# EAGLE schematic Layer 3 (EAGLE 9.6.2)

## Sheet 1 of 6
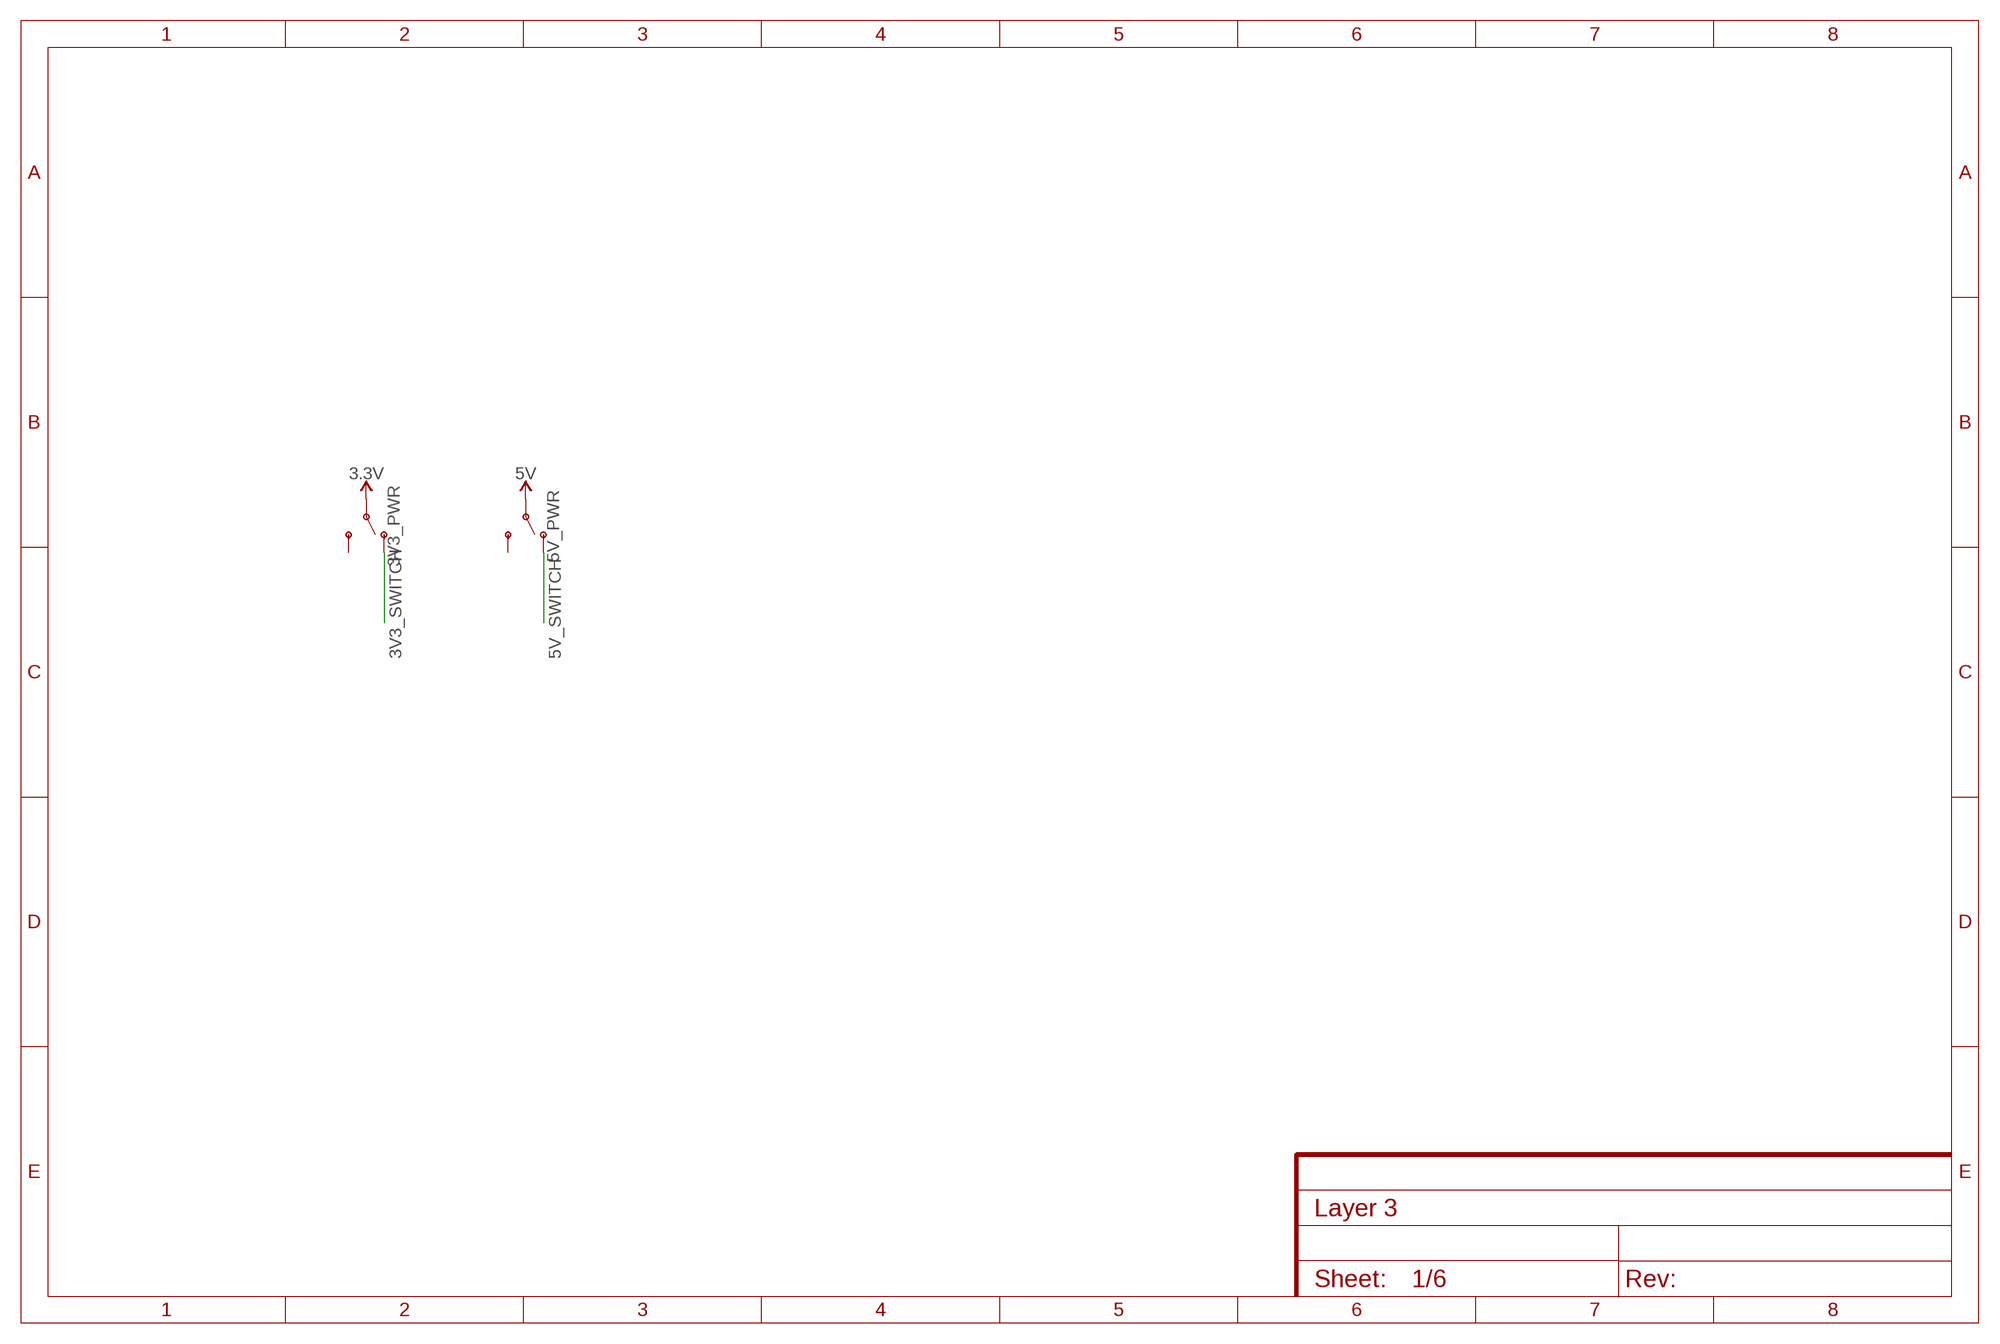
[diagram p0: schematic, sheet 1]

### Parts
3V3_PWR  SWITCH-SPDT-PTH-11.6X4.0MM-LOCK  [SWITCH_SPDT_PTH_11.6X4.0MM_LOCK]
5V_PWR  SWITCH-SPDT-PTH-11.6X4.0MM-LOCK  [SWITCH_SPDT_PTH_11.6X4.0MM_LOCK]

### Nets
3.3V: 3V3_PWR.2(P) ; also sheet 4,5,6
3V3_SWITCH: 3V3_PWR.1(O) ; also sheet 2,3,4,6
5V: 5V_PWR.2(P) ; also sheet 5
5V_SWITCH: 5V_PWR.1(O) ; also sheet 4
Unconnected: 3V3_PWR.3(S) 5V_PWR.3(S)

## Sheet 2 of 6: STEM32
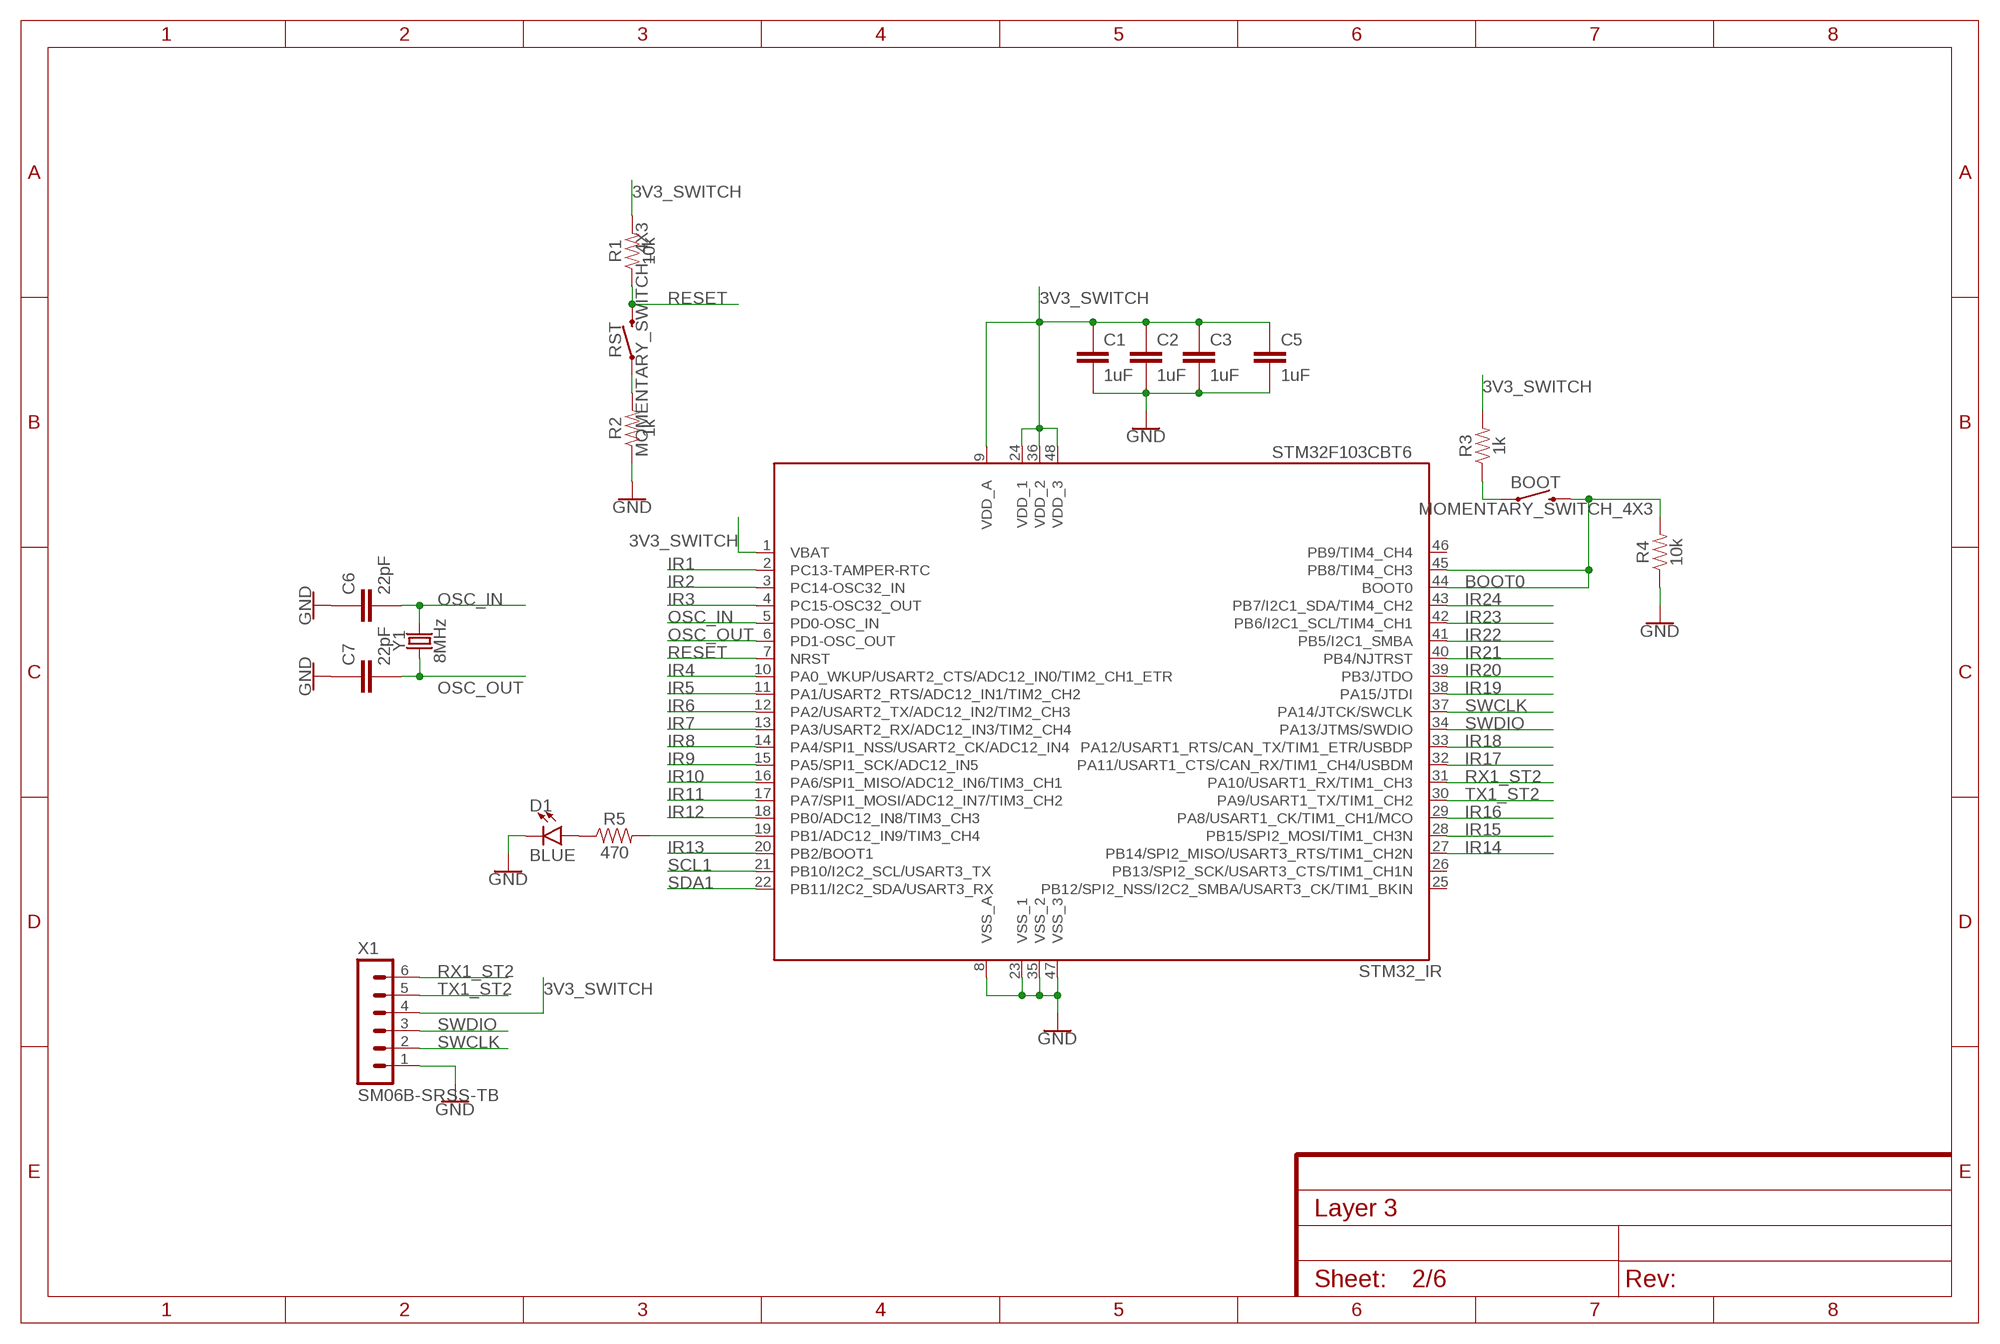
[diagram p1: schematic, sheet 2]

### Parts
BOOT  MOMENTARY_SWITCH_4X3  [MOMENTARY_SWITCH_4X3]
C1  1uF  CAPACITOR0603  [C0603]
C2  1uF  CAPACITOR0603  [C0603]
C3  1uF  CAPACITOR0603  [C0603]
C5  1uF  CAPACITOR0603  [C0603]
C6  22pF  CAPACITOR0603  [C0603]
C7  22pF  CAPACITOR0603  [C0603]
D1  BLUE  LED0603  [LED-0603]
R1  10k  RESISTOR0603  [R0603]
R2  1k  RESISTOR0603  [R0603]
R3  1k  RESISTOR0603  [R0603]
R4  10k  RESISTOR0603  [R0603]
R5  470  RESISTOR0603  [R0603]
RST  MOMENTARY_SWITCH_4X3  [MOMENTARY_SWITCH_4X3]
STM32_IR  STM32F103CBT6  [LQFP48]
X1  SM06B-SRSS-TB  [SM06B-SRSS-TB]
Y1  8MHz  CRYSTALSMD-5X3.2-2PAD  [CRYSTAL-SMD-5X3.2-2PAD]

### Nets
3V3_SWITCH: C1.1 C2.1 C3.1 C5.2 R1.2 R3.2 STM32_IR.1(VBAT) STM32_IR.9(VDD_A) STM32_IR.24(VDD_1) STM32_IR.36(VDD_2) STM32_IR.48(VDD_3) X1.4 ; also sheet 1,3,4,6
BOOT0: BOOT.P$2 R4.2 STM32_IR.44(BOOT0) STM32_IR.45(PB8/TIM4_CH3)
GND: C1.2 C2.2 C3.2 C5.1 C6.1 C7.1 D1.C R2.1 R4.1 STM32_IR.8(VSS_A) STM32_IR.23(VSS_1) STM32_IR.35(VSS_2) STM32_IR.47(VSS_3) X1.1 ; also sheet 3,4,5,6
IR1: STM32_IR.2(PC13-TAMPER-RTC) ; also sheet 3
IR2: STM32_IR.3(PC14-OSC32_IN) ; also sheet 3
IR3: STM32_IR.4(PC15-OSC32_OUT) ; also sheet 3
IR4: STM32_IR.10(PA0_WKUP/USART2_CTS/ADC12_IN0/TIM2_CH1_ETR) ; also sheet 3
IR5: STM32_IR.11(PA1/USART2_RTS/ADC12_IN1/TIM2_CH2) ; also sheet 3
IR6: STM32_IR.12(PA2/USART2_TX/ADC12_IN2/TIM2_CH3) ; also sheet 3
IR7: STM32_IR.13(PA3/USART2_RX/ADC12_IN3/TIM2_CH4) ; also sheet 3
IR8: STM32_IR.14(PA4/SPI1_NSS/USART2_CK/ADC12_IN4) ; also sheet 3
IR9: STM32_IR.15(PA5/SPI1_SCK/ADC12_IN5) ; also sheet 3
IR10: STM32_IR.16(PA6/SPI1_MISO/ADC12_IN6/TIM3_CH1) ; also sheet 3
IR11: STM32_IR.17(PA7/SPI1_MOSI/ADC12_IN7/TIM3_CH2) ; also sheet 3
IR12: STM32_IR.18(PB0/ADC12_IN8/TIM3_CH3) ; also sheet 3
IR13: STM32_IR.20(PB2/BOOT1) ; also sheet 3
IR14: STM32_IR.27(PB14/SPI2_MISO/USART3_RTS/TIM1_CH2N) ; also sheet 3
IR15: STM32_IR.28(PB15/SPI2_MOSI/TIM1_CH3N) ; also sheet 3
IR16: STM32_IR.29(PA8/USART1_CK/TIM1_CH1/MCO) ; also sheet 3
IR17: STM32_IR.32(PA11/USART1_CTS/CAN_RX/TIM1_CH4/USBDM) ; also sheet 3
IR18: STM32_IR.33(PA12/USART1_RTS/CAN_TX/TIM1_ETR/USBDP) ; also sheet 3
IR19: STM32_IR.38(PA15/JTDI) ; also sheet 3
IR20: STM32_IR.39(PB3/JTDO) ; also sheet 3
IR21: STM32_IR.40(PB4/NJTRST) ; also sheet 3
IR22: STM32_IR.41(PB5/I2C1_SMBA) ; also sheet 3
IR23: STM32_IR.42(PB6/I2C1_SCL/TIM4_CH1) ; also sheet 3
IR24: STM32_IR.43(PB7/I2C1_SDA/TIM4_CH2) ; also sheet 3
N$70: R2.2 RST.P$1
N$72: BOOT.P$1 R3.1
N$73: R5.2 STM32_IR.19(PB1/ADC12_IN9/TIM3_CH4)
N$74: D1.A R5.1
OSC_IN: C6.2 STM32_IR.5(PD0-OSC_IN) Y1.P$2
OSC_OUT: C7.2 STM32_IR.6(PD1-OSC_OUT) Y1.P$1
RESET: R1.1 RST.P$2 STM32_IR.7(NRST)
RX1_ST2: STM32_IR.31(PA10/USART1_RX/TIM1_CH3) X1.6 ; also sheet 4
SCL1: STM32_IR.21(PB10/I2C2_SCL/USART3_TX) ; also sheet 6
SDA1: STM32_IR.22(PB11/I2C2_SDA/USART3_RX) ; also sheet 6
SWCLK: STM32_IR.37(PA14/JTCK/SWCLK) X1.2
SWDIO: STM32_IR.34(PA13/JTMS/SWDIO) X1.3
TX1_ST2: STM32_IR.30(PA9/USART1_TX/TIM1_CH2) X1.5 ; also sheet 4
Unconnected: STM32_IR.25(PB12/SPI2_NSS/I2C2_SMBA/USART3_CK/TIM1_BKIN) STM32_IR.26(PB13/SPI2_SCK/USART3_CTS/TIM1_CH1N) STM32_IR.46(PB9/TIM4_CH4)

## Sheet 3 of 6: IR Sensor
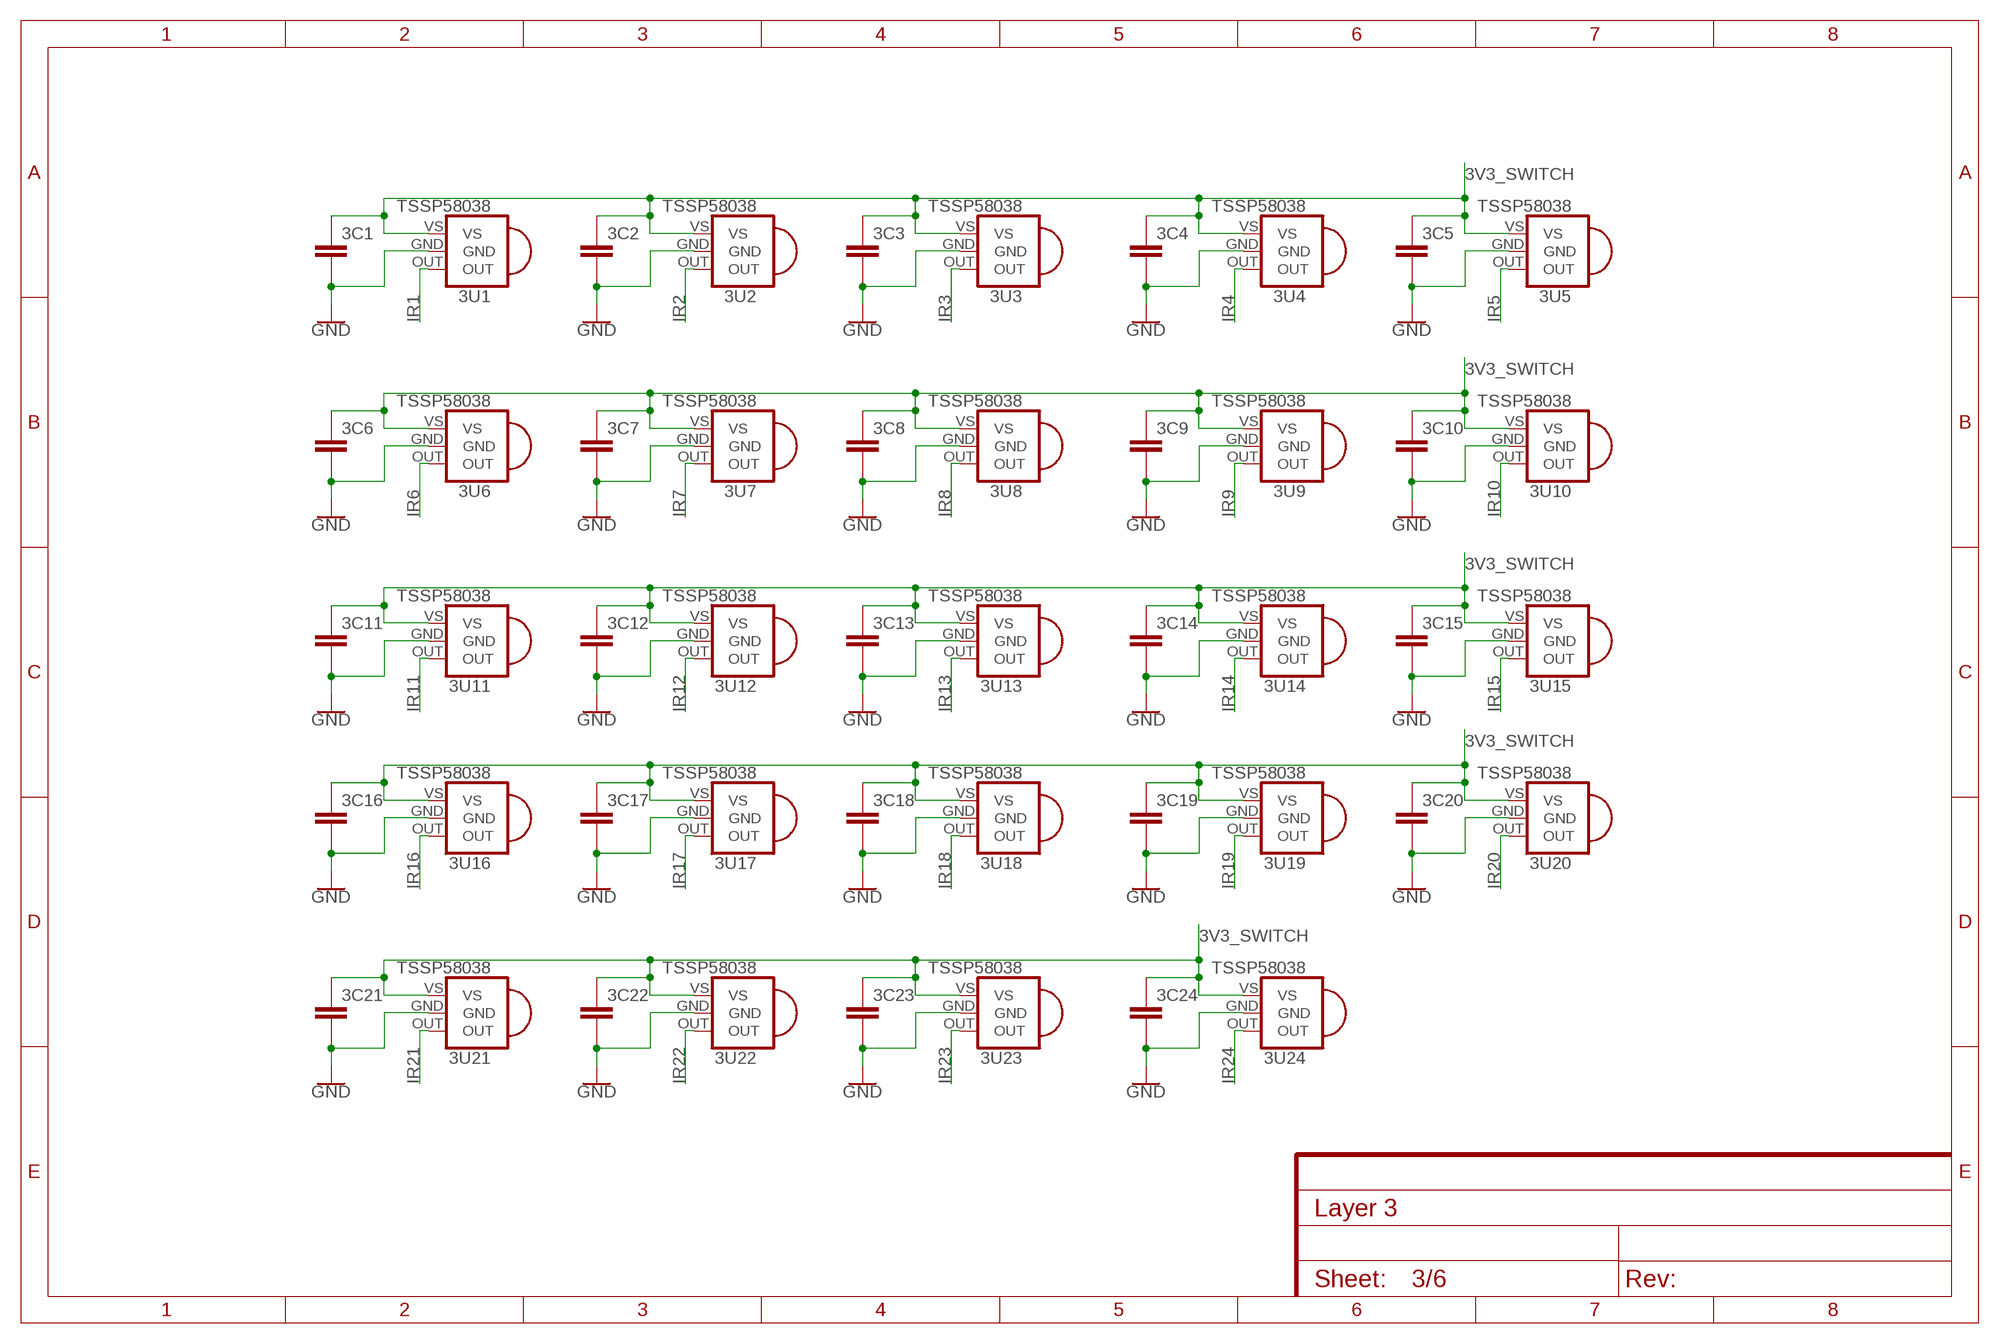
[diagram p2: schematic, sheet 3]

### Parts
3C1  CAPACITOR0603  [C0603]
3C2  CAPACITOR0603  [C0603]
3C3  CAPACITOR0603  [C0603]
3C4  CAPACITOR0603  [C0603]
3C5  CAPACITOR0603  [C0603]
3C6  CAPACITOR0603  [C0603]
3C7  CAPACITOR0603  [C0603]
3C8  CAPACITOR0603  [C0603]
3C9  CAPACITOR0603  [C0603]
3C10  CAPACITOR0603  [C0603]
3C11  CAPACITOR0603  [C0603]
3C12  CAPACITOR0603  [C0603]
3C13  CAPACITOR0603  [C0603]
3C14  CAPACITOR0603  [C0603]
3C15  CAPACITOR0603  [C0603]
3C16  CAPACITOR0603  [C0603]
3C17  CAPACITOR0603  [C0603]
3C18  CAPACITOR0603  [C0603]
3C19  CAPACITOR0603  [C0603]
3C20  CAPACITOR0603  [C0603]
3C21  CAPACITOR0603  [C0603]
3C22  CAPACITOR0603  [C0603]
3C23  CAPACITOR0603  [C0603]
3C24  CAPACITOR0603  [C0603]
3U1  TSSP58038  [TSSP58038]
3U2  TSSP58038  [TSSP58038]
3U3  TSSP58038  [TSSP58038]
3U4  TSSP58038  [TSSP58038]
3U5  TSSP58038  [TSSP58038]
3U6  TSSP58038  [TSSP58038]
3U7  TSSP58038  [TSSP58038]
3U8  TSSP58038  [TSSP58038]
3U9  TSSP58038  [TSSP58038]
3U10  TSSP58038  [TSSP58038]
3U11  TSSP58038  [TSSP58038]
3U12  TSSP58038  [TSSP58038]
3U13  TSSP58038  [TSSP58038]
3U14  TSSP58038  [TSSP58038]
3U15  TSSP58038  [TSSP58038]
3U16  TSSP58038  [TSSP58038]
3U17  TSSP58038  [TSSP58038]
3U18  TSSP58038  [TSSP58038]
3U19  TSSP58038  [TSSP58038]
3U20  TSSP58038  [TSSP58038]
3U21  TSSP58038  [TSSP58038]
3U22  TSSP58038  [TSSP58038]
3U23  TSSP58038  [TSSP58038]
3U24  TSSP58038  [TSSP58038]

### Nets
3V3_SWITCH: 3C1.1 3C2.1 3C3.1 3C4.1 3C5.1 3C6.1 3C7.1 3C8.1 3C9.1 3C10.1 3C11.1 3C12.1 3C13.1 3C14.1 3C15.1 3C16.1 3C17.1 3C18.1 3C19.1 3C20.1 3C21.1 3C22.1 3C23.1 3C24.1 3U1.VS 3U2.VS 3U3.VS 3U4.VS 3U5.VS 3U6.VS 3U7.VS 3U8.VS 3U9.VS 3U10.VS 3U11.VS 3U12.VS 3U13.VS 3U14.VS 3U15.VS 3U16.VS 3U17.VS 3U18.VS 3U19.VS 3U20.VS 3U21.VS 3U22.VS 3U23.VS 3U24.VS ; also sheet 1,2,4,6
GND: 3C1.2 3C2.2 3C3.2 3C4.2 3C5.2 3C6.2 3C7.2 3C8.2 3C9.2 3C10.2 3C11.2 3C12.2 3C13.2 3C14.2 3C15.2 3C16.2 3C17.2 3C18.2 3C19.2 3C20.2 3C21.2 3C22.2 3C23.2 3C24.2 3U1.GND 3U2.GND 3U3.GND 3U4.GND 3U5.GND 3U6.GND 3U7.GND 3U8.GND 3U9.GND 3U10.GND 3U11.GND 3U12.GND 3U13.GND 3U14.GND 3U15.GND 3U16.GND 3U17.GND 3U18.GND 3U19.GND 3U20.GND 3U21.GND 3U22.GND 3U23.GND 3U24.GND ; also sheet 2,4,5,6
IR1: 3U1.OUT ; also sheet 2
IR2: 3U2.OUT ; also sheet 2
IR3: 3U3.OUT ; also sheet 2
IR4: 3U4.OUT ; also sheet 2
IR5: 3U5.OUT ; also sheet 2
IR6: 3U6.OUT ; also sheet 2
IR7: 3U7.OUT ; also sheet 2
IR8: 3U8.OUT ; also sheet 2
IR9: 3U9.OUT ; also sheet 2
IR10: 3U10.OUT ; also sheet 2
IR11: 3U11.OUT ; also sheet 2
IR12: 3U12.OUT ; also sheet 2
IR13: 3U13.OUT ; also sheet 2
IR14: 3U14.OUT ; also sheet 2
IR15: 3U15.OUT ; also sheet 2
IR16: 3U16.OUT ; also sheet 2
IR17: 3U17.OUT ; also sheet 2
IR18: 3U18.OUT ; also sheet 2
IR19: 3U19.OUT ; also sheet 2
IR20: 3U20.OUT ; also sheet 2
IR21: 3U21.OUT ; also sheet 2
IR22: 3U22.OUT ; also sheet 2
IR23: 3U23.OUT ; also sheet 2
IR24: 3U24.OUT ; also sheet 2

## Sheet 4 of 6
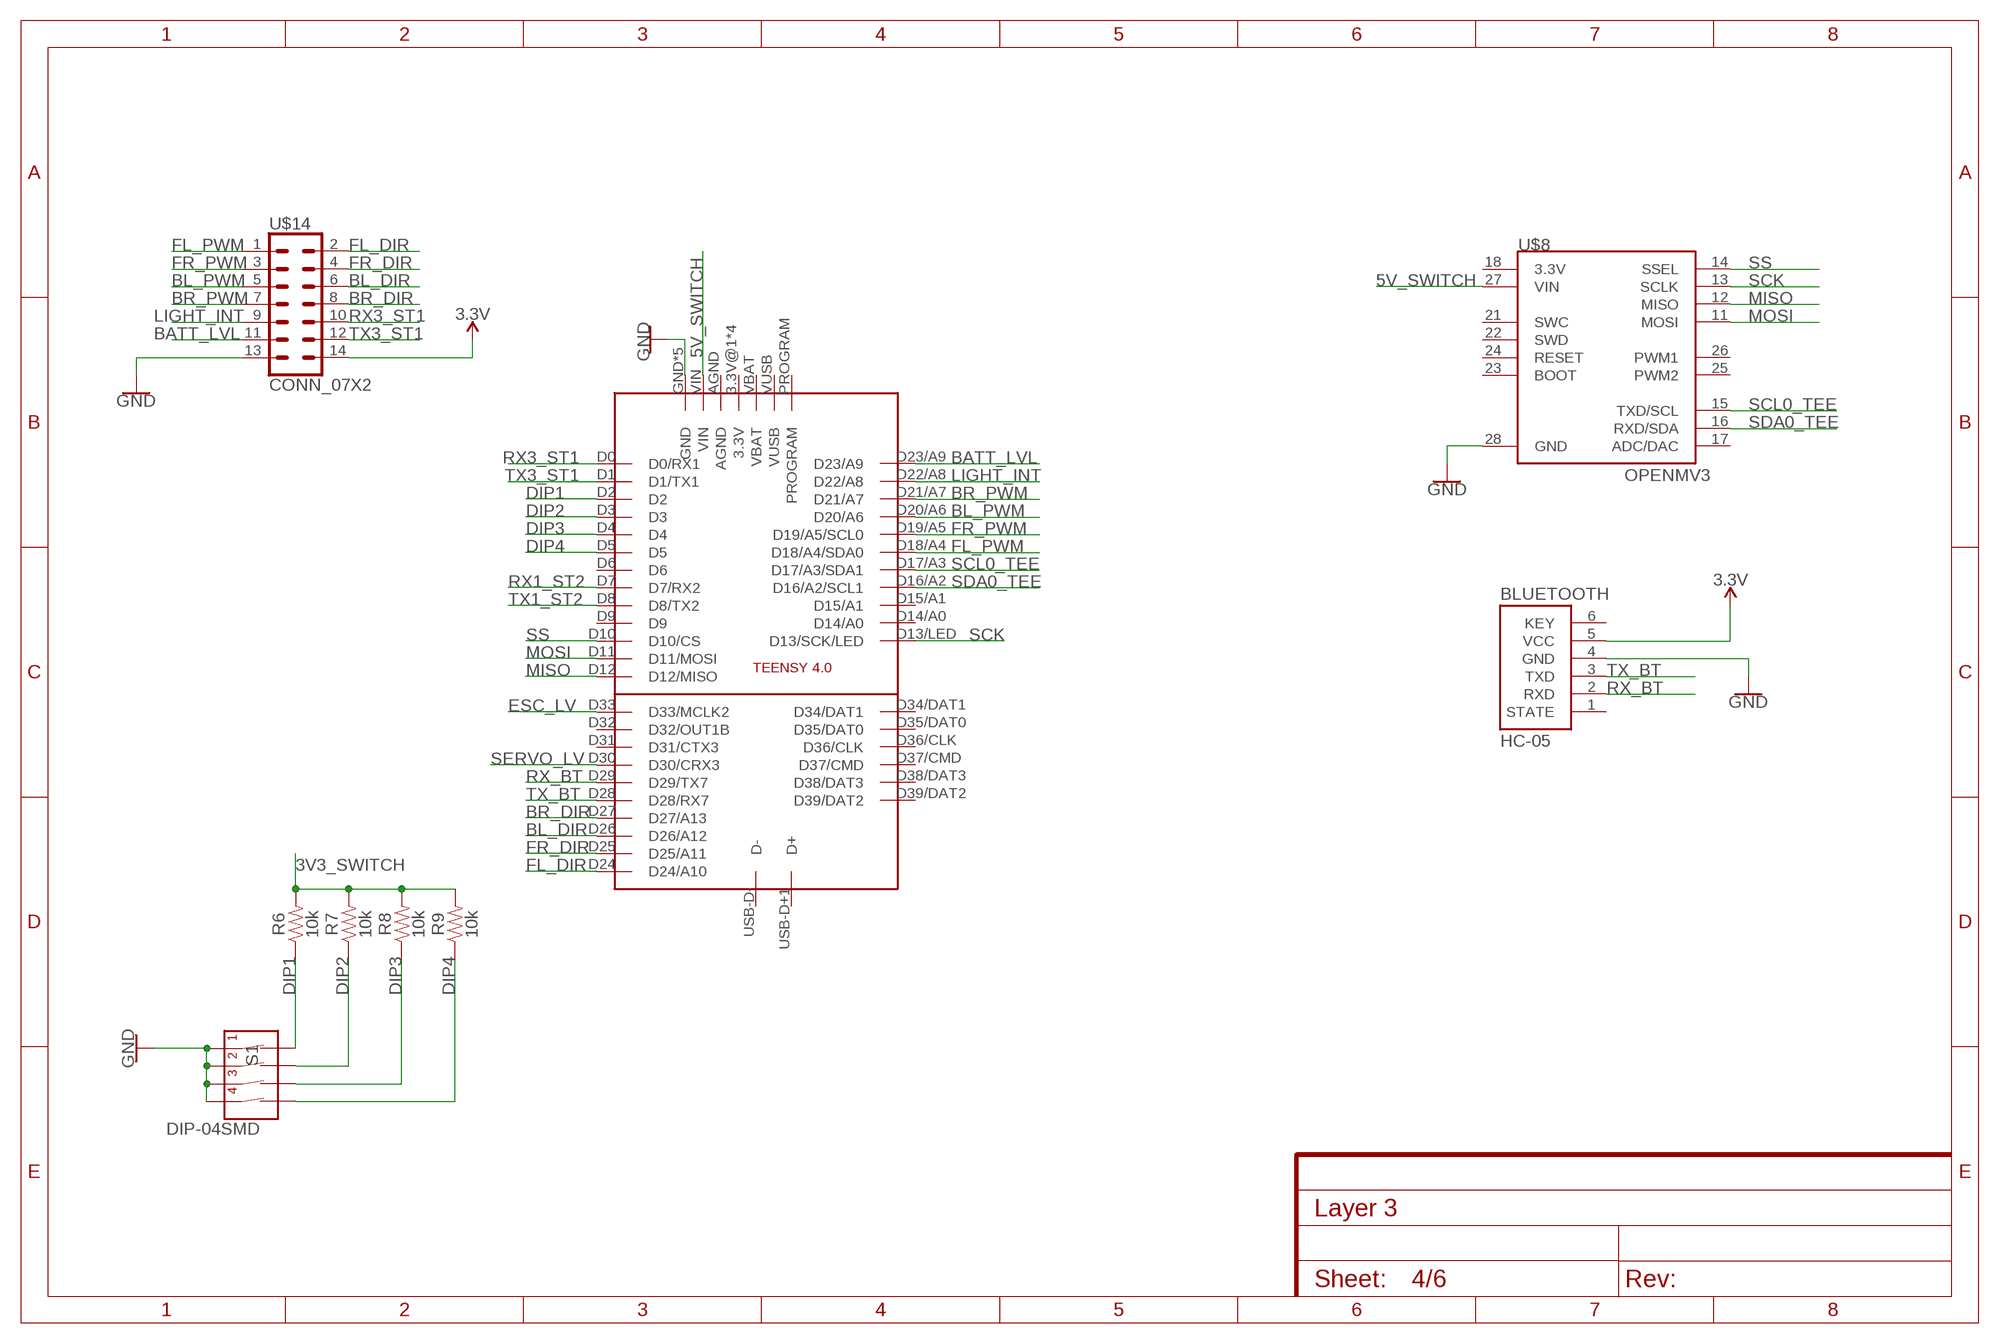
[diagram p3: schematic, sheet 4]

### Parts
BLUETOOTH  HC-05  [HC-05]
R6  10k  RESISTOR0603  [R0603]
R7  10k  RESISTOR0603  [R0603]
R8  10k  RESISTOR0603  [R0603]
R9  10k  RESISTOR0603  [R0603]
S1  DIP-04SMD  [DIPSWITCH-04-SMD]
TEENSY4  TEENSY-4.0-FULL-BREAKOUT-PINS  [TEENSY-4.0-FULL-BREAKOUT-PINS]
U$8  OPENMV3  [OPENMV3]
U$14  CONN_07X2  [2X7]

### Nets
3.3V: BLUETOOTH.5(VCC) U$14.14 ; also sheet 1,5,6
3V3_SWITCH: R6.2 R7.2 R8.2 R9.2 ; also sheet 1,2,3,6
5V_SWITCH: TEENSY4.VIN U$8.27(VIN) ; also sheet 1
BATT_LVL: TEENSY4.D23/A9 U$14.11
BL_DIR: TEENSY4.D26(D26/A12) U$14.6
BL_PWM: TEENSY4.D20/A6 U$14.5
BR_DIR: TEENSY4.D27(D27/A13) U$14.8
BR_PWM: TEENSY4.D21/A7 U$14.7
DIP1: R6.1 S1.1(1A) TEENSY4.D2
DIP2: R7.1 S1.2(2A) TEENSY4.D3
DIP3: R8.1 S1.3(3A) TEENSY4.D4
DIP4: R9.1 S1.4(4A) TEENSY4.D5
ESC_LV: TEENSY4.D33(D33/MCLK2) ; also sheet 5
FL_DIR: TEENSY4.D24(D24/A10) U$14.2
FL_PWM: TEENSY4.D18/A4(D18/A4/SDA0) U$14.1
FR_DIR: TEENSY4.D25(D25/A11) U$14.4
FR_PWM: TEENSY4.D19/A5(D19/A5/SCL0) U$14.3
GND: BLUETOOTH.4(GND) S1.5(4B) S1.6(3B) S1.7(2B) S1.8(1B) TEENSY4.GND TEENSY4.GND@1(GND) TEENSY4.GND@2(GND) TEENSY4.P$11(GND) TEENSY4.P$12(GND) U$8.28(GND) U$14.13 ; also sheet 2,3,5,6
LIGHT_INT: TEENSY4.D22/A8 U$14.9
MISO: TEENSY4.D12(D12/MISO) U$8.12(MISO)
MOSI: TEENSY4.D11(D11/MOSI) U$8.11(MOSI)
RX1_ST2: TEENSY4.D7(D7/RX2) ; also sheet 2
RX3_ST1: TEENSY4.D0(D0/RX1) U$14.10
RX_BT: BLUETOOTH.2(RXD) TEENSY4.D29(D29/TX7)
SCK: TEENSY4.D13/LED(D13/SCK/LED) U$8.13(SCLK)
SCL0_TEE: TEENSY4.D17/A3(D17/A3/SDA1) U$8.15(TXD/SCL)
SDA0_TEE: TEENSY4.D16/A2(D16/A2/SCL1) U$8.16(RXD/SDA)
SERVO_LV: TEENSY4.D30(D30/CRX3) ; also sheet 5
SS: TEENSY4.D10(D10/CS) U$8.14(SSEL)
TX1_ST2: TEENSY4.D8(D8/TX2) ; also sheet 2
TX3_ST1: TEENSY4.D1(D1/TX1) U$14.12
TX_BT: BLUETOOTH.3(TXD) TEENSY4.D28(D28/RX7)
Unconnected: BLUETOOTH.1(STATE) BLUETOOTH.6(KEY) TEENSY4.3.3V@1(3.3V) TEENSY4.3.3V@2(3.3V) TEENSY4.3V3(3.3V) TEENSY4.AGND TEENSY4.D6 TEENSY4.D9 TEENSY4.D14/A0 TEENSY4.D15/A1 TEENSY4.D31(D31/CTX3) TEENSY4.D32(D32/OUT1B) TEENSY4.D34/DAT1 TEENSY4.D35/DAT0 TEENSY4.D36/CLK TEENSY4.D37/CMD TEENSY4.D38/DAT3 TEENSY4.D39/DAT2 TEENSY4.ON/OFF(3.3V) TEENSY4.PROGRAM TEENSY4.USB-D+1(D+) TEENSY4.USB-D-(D-) TEENSY4.VBAT TEENSY4.VUSB U$8.17(ADC/DAC) U$8.18(3.3V) U$8.21(SWC) U$8.22(SWD) U$8.23(BOOT) U$8.24(RESET) U$8.25(PWM2) U$8.26(PWM1)

## Sheet 5 of 6: ESC + Servo
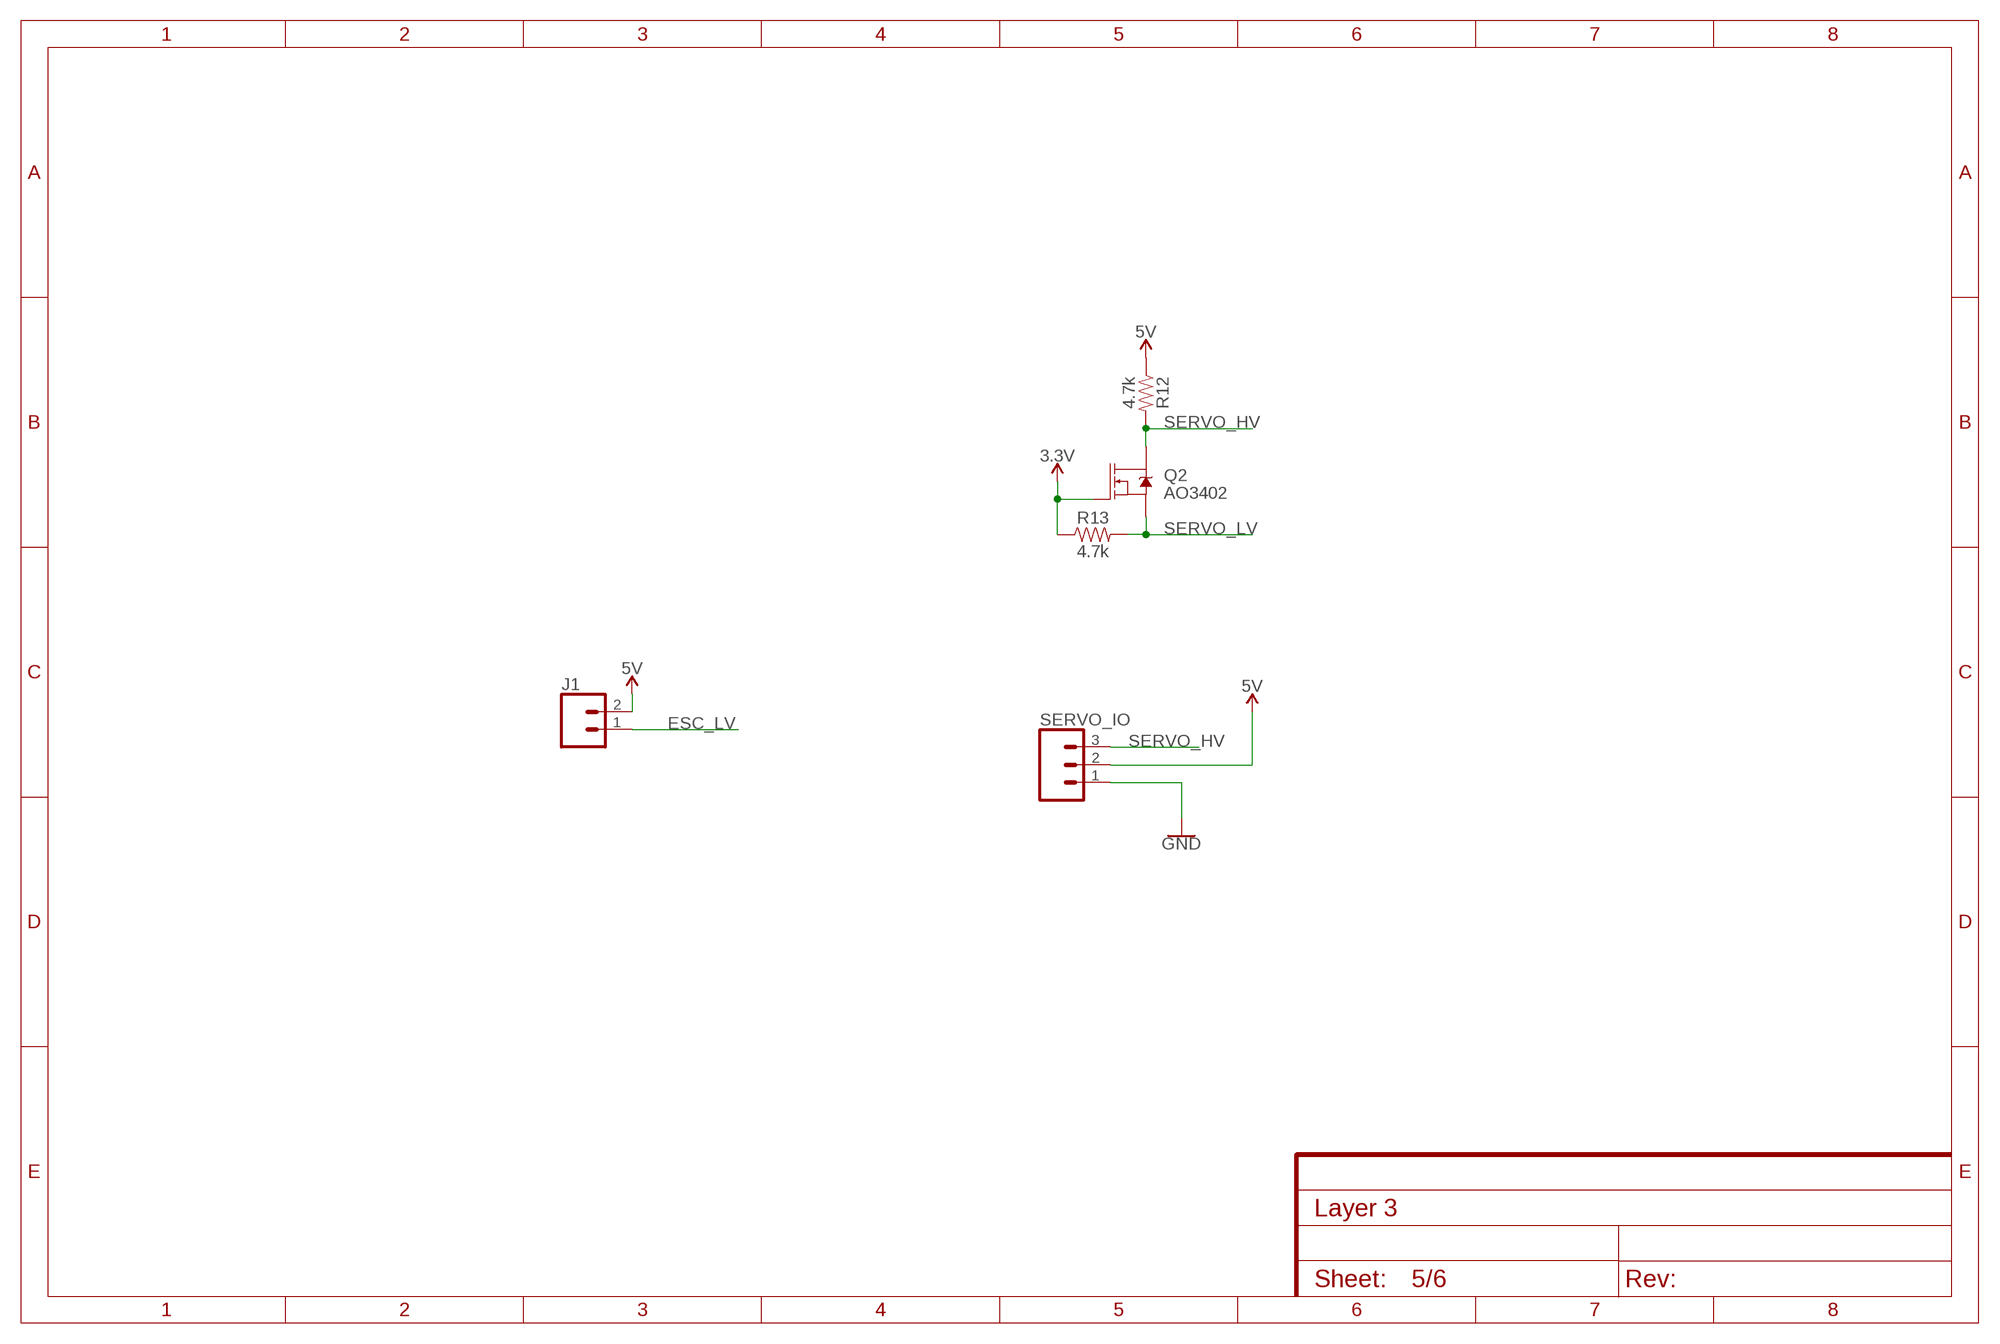
[diagram p4: schematic, sheet 5]

### Parts
J1  CONN_02LOCK  [1X02_LOCK]
Q2  AO3402  MOSFET-NCH-AO3404A  [SOT23-3]
R12  4.7k  RESISTOR0603  [R0603]
R13  4.7k  RESISTOR0603  [R0603]
SERVO_IO  CONN_03LOCK  [1X03_LOCK]

### Nets
3.3V: Q2.1(G) R13.1 ; also sheet 1,4,6
5V: J1.2 R12.1 SERVO_IO.2 ; also sheet 1
ESC_LV: J1.1 ; also sheet 4
GND: SERVO_IO.1 ; also sheet 2,3,4,6
SERVO_HV: Q2.3(D) R12.2 SERVO_IO.3
SERVO_LV: Q2.2(S) R13.2 ; also sheet 4

## Sheet 6 of 6: Compass
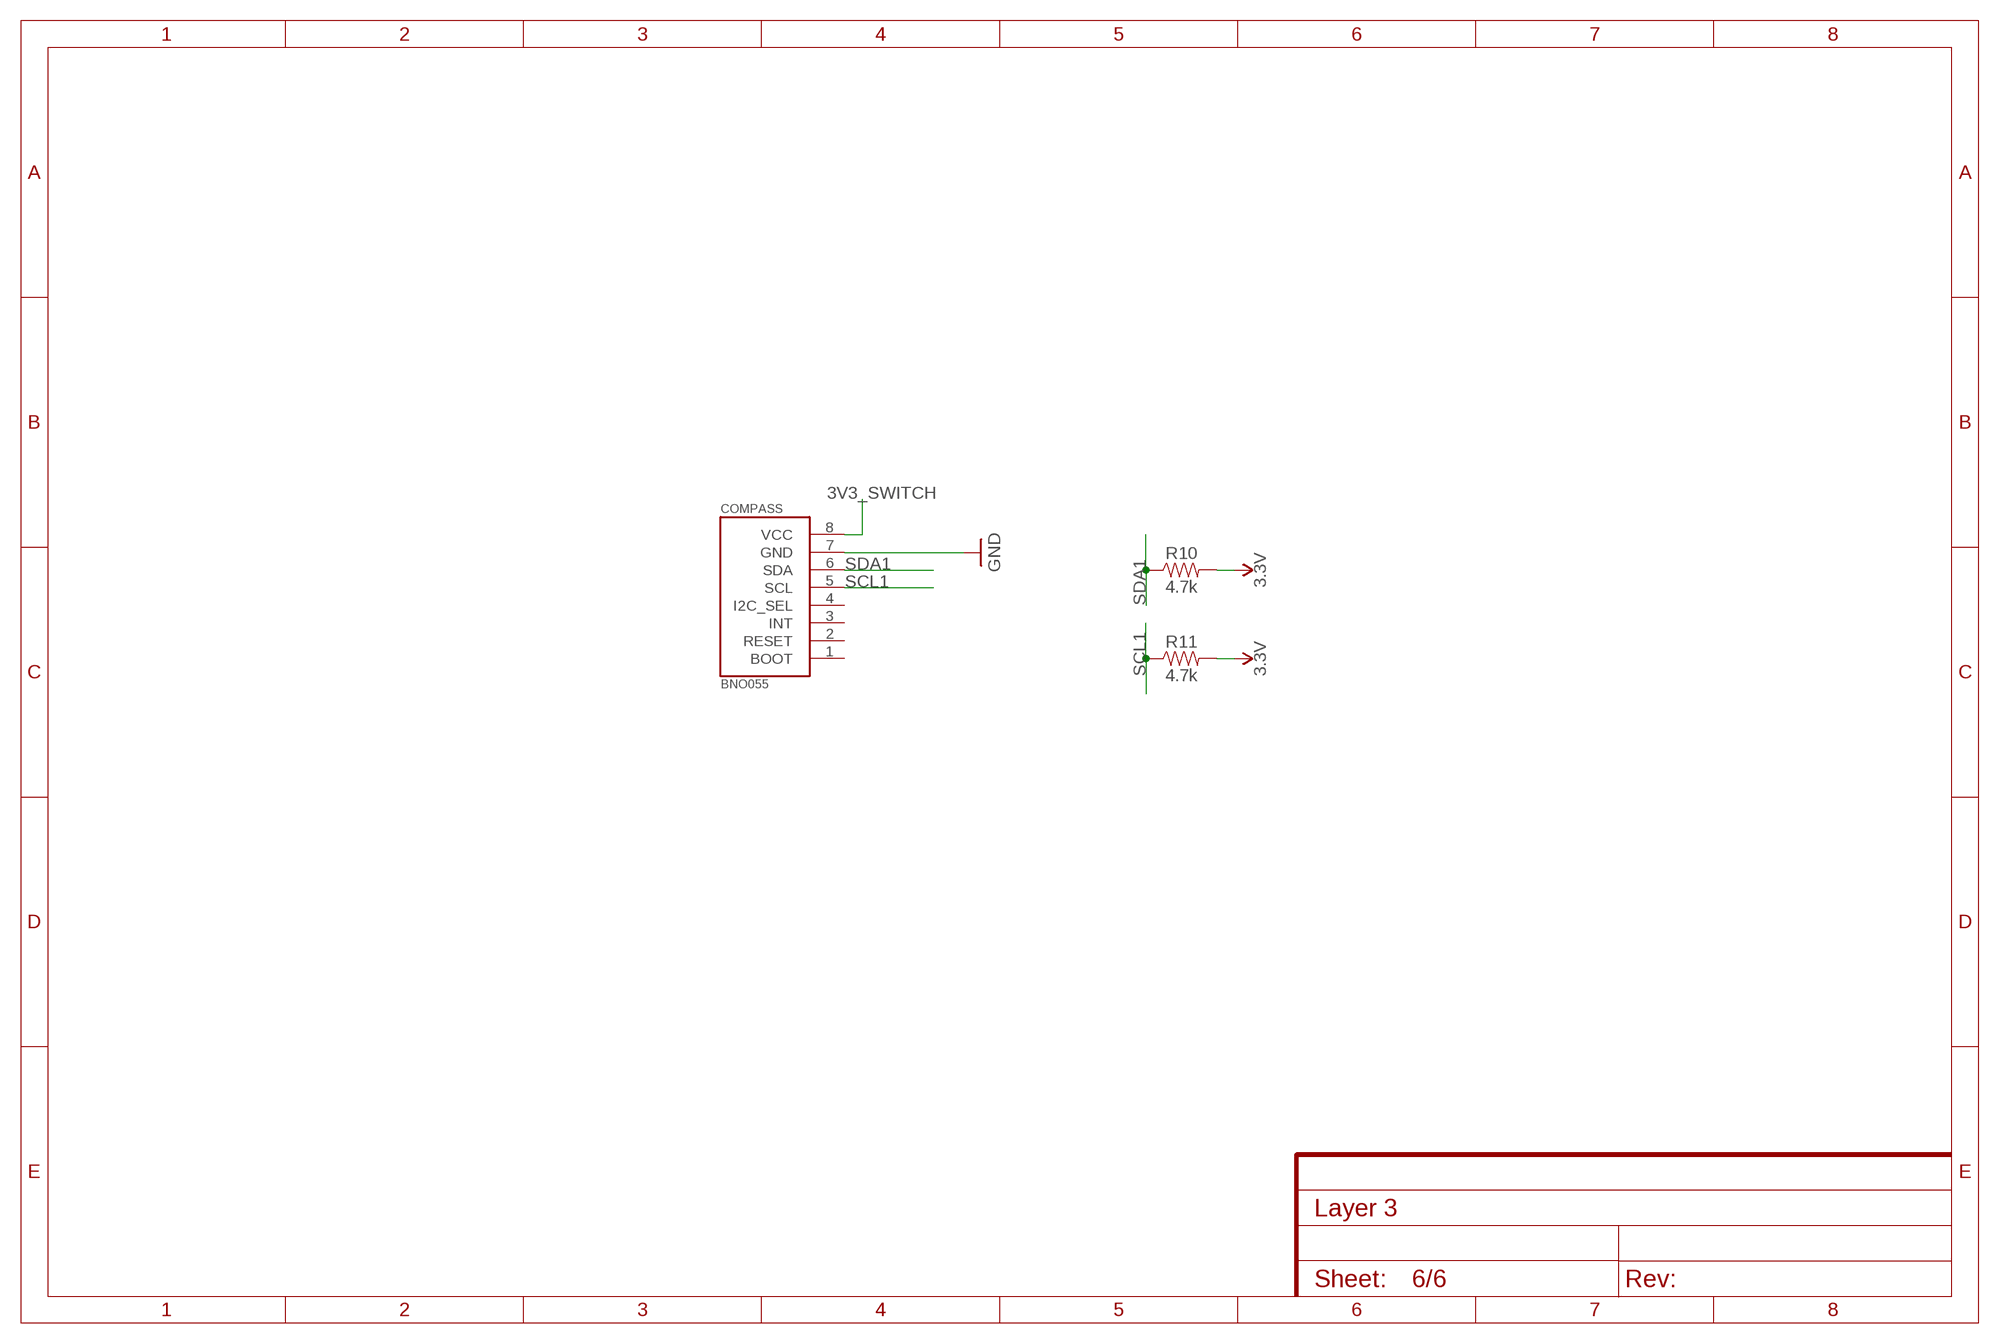
[diagram p5: schematic, sheet 6]

### Parts
COMPASS  BNO055  [BNO055]
R10  4.7k  4.7KOHM-0603-1/10W-1%  [0603]
R11  4.7k  4.7KOHM-0603-1/10W-1%  [0603]

### Nets
3.3V: R10.2 R11.2 ; also sheet 1,4,5
3V3_SWITCH: COMPASS.8(VCC) ; also sheet 1,2,3,4
GND: COMPASS.7(GND) ; also sheet 2,3,4,5
SCL1: COMPASS.5(SCL) R11.1 ; also sheet 2
SDA1: COMPASS.6(SDA) R10.1 ; also sheet 2
Unconnected: COMPASS.1(BOOT) COMPASS.2(RESET) COMPASS.3(INT) COMPASS.4(I2C_SEL)

## Library data of the parts
3C1-3C24 C1-C3 C5-C7 = JH:CAPACITOR
3U1-3U24 = JH:TSSP58038
3V3_PWR 5V_PWR = SparkFun-Switches:SWITCH-SPDT: Single Pole, Double Throw (SPDT) Switch Single-pole, double-throw (SPDT) switch. Variant Overview SMD-AYZ0202 Surface Mount DPDT Switch <https://www.sparkfun.com/products/597> (COM-00597) Used on e.g. LilyPad Arduino USB - ATmega32U4 Board <https://www.sparkfun.com/products/12049> PTH-11.6X4.0MM SPDT Mini Power Switch <https://www.sparkfun.com/products/102> (COM-00102) Used on e.g. SparkFun Simon Says - Through-Hole Soldering Kit <https://www.sparkfun.com/products/10547> (KIT-10547) PTH-11.6X4.0MM-KIT KIT version of SPDT Mini Power Switch - Simplifies soldering by removing tStop of switch pins - only one side can be soldered. PTH-11.6X4.0MM-LOCK LOCK version of SPDT Mini Power Switch - Offset pins hold switch in place for easier soldering. SMD-RIGHT-ANGLE Surface Mount Right Angle Switch <https://www.sparkfun.com/products/10860> (COM-10860) Used on e.g. SparkFun ESP8266 Thing <https://www.sparkfun.com/products/13231>; PROD_ID: SWCH-08261; SF_SKU: COM-00102
BLUETOOTH = JH:HC-05
BOOT RST = MY-LIBRARY:MOMENTARY_SWITCH_4X3
COMPASS = JH:BNO055
D1 = SparkFun-LED:LED: LED (Generic) Standard schematic elements and footprints for 5mm, 3mm, 1206, and 0603 sized LEDs. Generic LEDs with no color specified.
J1 = Connectors:CONN_02: Multi connection point. Often used as Generic Header-pin footprint for 0.1 inch spaced/style header connections On any of the 0.1 inch spaced packages, you can populate with these: Break Away Headers - Straight <https://www.sparkfun.com/products/116> (PRT-00116) Break Away Male Headers - Right Angle <https://www.sparkfun.com/products/553> (PRT-00553) Female Headers <https://www.sparkfun.com/products/115> (PRT-00115) Break Away Headers - Machine Pin <https://www.sparkfun.com/products/117> (PRT-00117) Break Away Female Headers - Swiss Machine Pin <https://www.sparkfun.com/products/743> (PRT-00743) For SCREWTERMINALS and SPRING TERMINALS visit here: Screw Terimnals on SparkFun.com <https://www.sparkfun.com/search/results?term=Screw+Terminals> (5mm/3.5mm/2.54mm spacing) This device is also useful as a general connection point to wire up your design to another part of your project. Our various solder wires solder well into these plated through hole pads. Hook-Up Wire - Assortment (Stranded, 22 AWG) <https://www.sparkfun.com/products/11375> (PRT-11375) Hook-Up Wire - Assortment (Solid Core, 22 AWG) <https://www.sparkfun.com/products/11367> (PRT-11367) View the entire wire category on our website here <https://www.sparkfun.com/categories/141> Special notes: Molex polarized connector foot print use with: PRT-08233 with associated crimp pins and housings. 2.54_SCREWTERM for use with PRT-10571. 3.5mm Screw Terminal footprints for PRT-08084 5mm Screw Terminal footprints for use with PRT-08432
Q2 = SparkFun-DiscreteSemi:MOSFET-NCH: N-channel MOSFETs Voltage controlled devices that allow control of high current outputs. SparkFun Products: SparkFun OpenScale <https://www.sparkfun.com/products/13261> SparkFun Digital Sandbox <https://www.sparkfun.com/products/12651> SparkFun Monster Moto Shield <https://www.sparkfun.com/products/10182> SparkFun MOSFET Power Controller <https://www.sparkfun.com/products/11214>; PROD_ID: TRANS-12988; VALUE: 5.8A/30V/35mΩ
R1-R9 R12 R13 = JH:RESISTOR
R10 R11 = SparkFun-Resistors:4.7KOHM: 4.7kΩ resistor A resistor is a passive two-terminal electrical component that implements electrical resistance as a circuit element. Resistors act to reduce current flow, and, at the same time, act to lower voltage levels within circuits. - Wikipedia; PROD_ID: RES-07857
S1 = SparkFun-Switches:DIP-04: 4-Position DIP Switch 4-circuit DIP (dual inline package) switch. Commonly used to physcially set a circuit's behavior. SparkFun Products Prototype Part
SERVO_IO = SparkFun-Connectors:CONN_03: Multi connection point. Often used as Generic Header-pin footprint for 0.1 inch spaced/style header connections On any of the 0.1 inch spaced packages, you can populate with these: Break Away Headers - Straight <https://www.sparkfun.com/products/116> (PRT-00116) Break Away Male Headers - Right Angle <https://www.sparkfun.com/products/553> (PRT-00553) Female Headers <https://www.sparkfun.com/products/115> (PRT-00115) Break Away Headers - Machine Pin <https://www.sparkfun.com/products/117> (PRT-00117) Break Away Female Headers - Swiss Machine Pin <https://www.sparkfun.com/products/743> (PRT-00743) Stackable Header - 3 Pin (Female, 0.1") <https://www.sparkfun.com/products/13875> (PRT-13875) For SCREWTERMINALS and SPRING TERMINALS visit here: Screw Terimnals on SparkFun.com <https://www.sparkfun.com/search/results?term=Screw+Terminals> (5mm/3.5mm/2.54mm spacing) This device is also useful as a general connection point to wire up your design to another part of your project. Our various solder wires solder well into these plated through hole pads. Hook-Up Wire - Assortment (Stranded, 22 AWG) <https://www.sparkfun.com/products/11375> (PRT-11375) Hook-Up Wire - Assortment (Solid Core, 22 AWG) <https://www.sparkfun.com/products/11367> (PRT-11367) View the entire wire category on our website here <https://www.sparkfun.com/categories/141> Special notes: Molex polarized connector foot print use with SKU : PRT-08232 with associated crimp pins and housings.
STM32_IR = JH:STM32F103CBT6
TEENSY4 = Teensy-4.0:TEENSY-4.0-FULL-BREAKOUT-PINS
U$8 = openmv:OPENMV3
U$14 = MY-LIBRARY:CONN_07X2
X1 = con-JST SH:SM06B-SRSS: JST SH series header 1.00mm pitch disconnectable crimp style connectors, horizontal (side entry type), 6 pins
Y1 = SparkFun-Clocks:CRYSTAL: Crystals (Generic) These are passive quartz crystals, which can be used as a clock source for a microcontroller. Crystal's are two-terminal devices. They require external "load" capacitors to generate an oscillating signal.

## Net classes
0 default: clearance 0.205 mm